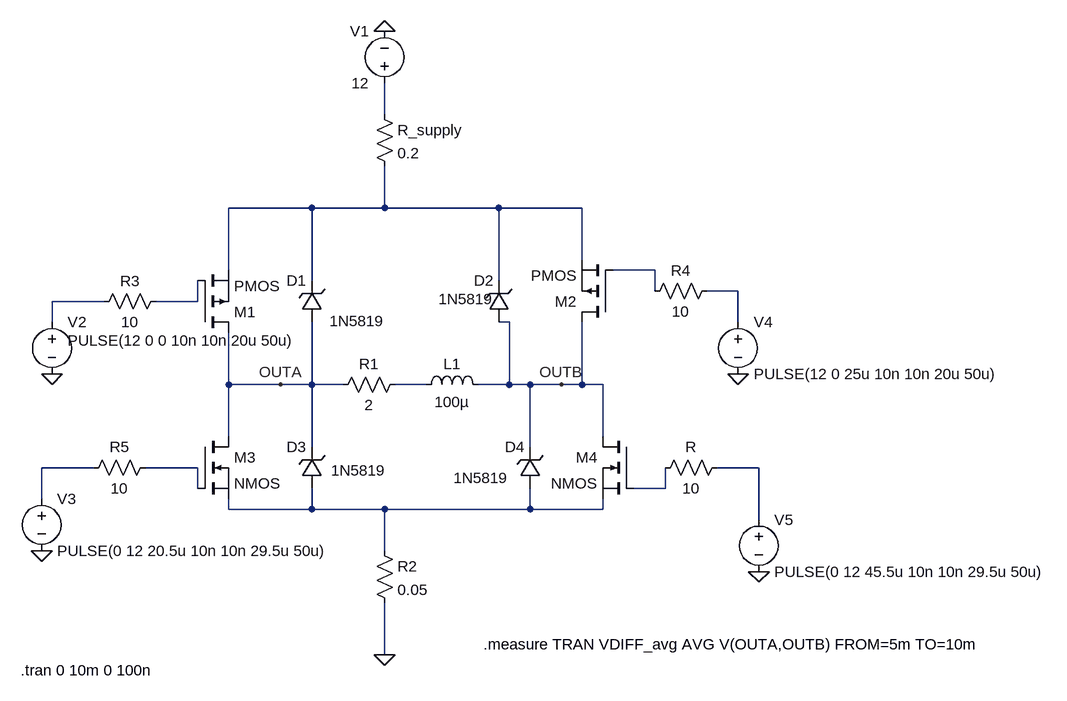
[diagram p0: schematic LTspice_circuit_test_v_diff_basic.asc]
LTspice_circuit_test_v_diff_basic.asc, the LTspice schematic file:
Version 4.1
SHEET 1 1772 968
WIRE 128 96 128 48
WIRE 16 240 -112 240
WIRE 128 240 128 176
WIRE 128 240 16 240
WIRE 304 240 128 240
WIRE 432 240 304 240
WIRE 432 320 432 240
WIRE -112 336 -112 240
WIRE 544 336 480 336
WIRE 16 352 16 240
WIRE 304 352 304 240
WIRE 544 368 544 336
WIRE 672 368 624 368
WIRE -304 384 -384 384
WIRE -160 384 -160 352
WIRE -160 384 -224 384
WIRE -384 416 -384 384
WIRE 320 416 304 416
WIRE 672 416 672 368
WIRE -112 512 -112 432
WIRE -32 512 -112 512
WIRE 16 512 16 416
WIRE 16 512 -32 512
WIRE 64 512 16 512
WIRE 192 512 144 512
WIRE 320 512 320 416
WIRE 320 512 272 512
WIRE 352 512 320 512
WIRE 400 512 352 512
WIRE 432 512 432 416
WIRE 432 512 400 512
WIRE 464 512 432 512
WIRE -112 592 -112 512
WIRE 464 592 464 512
WIRE 16 608 16 512
WIRE 352 608 352 512
WIRE -320 640 -400 640
WIRE -160 640 -240 640
WIRE 704 640 640 640
WIRE -160 672 -160 640
WIRE 560 672 560 640
WIRE 560 672 512 672
WIRE -400 688 -400 640
WIRE -112 704 -112 688
WIRE 16 704 16 672
WIRE 16 704 -112 704
WIRE 128 704 16 704
WIRE 352 704 352 672
WIRE 352 704 128 704
WIRE 464 704 464 688
WIRE 464 704 352 704
WIRE 704 720 704 640
WIRE 128 768 128 704
WIRE 128 928 128 848
FLAG 672 496 0
FLAG 704 800 0
FLAG -400 768 0
FLAG -384 496 0
FLAG 128 -32 0
FLAG 128 928 0
FLAG -32 512 OUTA
FLAG 400 512 OUTB
SYMBOL voltage 128 64 R180
WINDOW 0 24 96 Left 2
WINDOW 3 24 16 Left 2
WINDOW 123 0 0 Left 0
WINDOW 39 0 0 Left 0
SYMATTR InstName V1
SYMATTR Value 12
SYMBOL nmos -160 592 R0
SYMATTR InstName M3
SYMBOL nmos 512 592 M0
SYMATTR InstName M4
SYMBOL zener 32 416 R180
WINDOW 0 24 64 Left 2
WINDOW 3 -96 2 Left 2
SYMATTR InstName D1
SYMATTR Value 1N5819
SYMBOL zener 320 416 R180
WINDOW 0 24 64 Left 2
WINDOW 3 24 36 Left 2
SYMATTR InstName D2
SYMATTR Value 1N5819
SYMBOL zener 32 672 R180
WINDOW 0 24 64 Left 2
WINDOW 3 -98 28 Left 2
SYMATTR InstName D3
SYMATTR Value 1N5819
SYMBOL zener 368 672 R180
WINDOW 0 24 64 Left 2
WINDOW 3 49 16 Left 2
SYMATTR InstName D4
SYMATTR Value 1N5819
SYMBOL res 160 496 R90
WINDOW 0 0 56 VBottom 2
WINDOW 3 32 56 VTop 2
SYMATTR InstName R1
SYMATTR Value 2
SYMBOL ind 176 528 R270
WINDOW 0 32 56 VTop 2
WINDOW 3 5 56 VBottom 2
SYMATTR InstName L1
SYMATTR Value 100µ
SYMBOL voltage -384 400 R0
WINDOW 3 24 44 Left 2
WINDOW 123 0 0 Left 0
WINDOW 39 0 0 Left 0
SYMATTR InstName V2
SYMATTR Value PULSE(12 0 0 10n 10n 20u 50u)
SYMBOL voltage -400 672 R0
WINDOW 123 0 0 Left 0
WINDOW 39 0 0 Left 0
SYMATTR InstName V3
SYMATTR Value PULSE(0 12 20.5u 10n 10n 29.5u 50u)
SYMBOL voltage 672 400 R0
WINDOW 123 0 0 Left 0
WINDOW 39 0 0 Left 0
SYMATTR InstName V4
SYMATTR Value PULSE(12 0 25u 10n 10n 20u 50u)
SYMBOL voltage 704 704 R0
WINDOW 123 0 0 Left 0
WINDOW 39 0 0 Left 0
SYMATTR InstName V5
SYMATTR Value PULSE(0 12 45.5u 10n 10n 29.5u 50u)
SYMBOL res 112 752 R0
SYMATTR InstName R2
SYMATTR Value 0.05
SYMBOL res 112 80 R0
SYMATTR InstName R_supply
SYMATTR Value 0.2
SYMBOL res -208 368 R90
WINDOW 0 0 56 VBottom 2
WINDOW 3 32 56 VTop 2
SYMATTR InstName R3
SYMATTR Value 10
SYMBOL res 640 352 R90
WINDOW 0 0 56 VBottom 2
WINDOW 3 32 56 VTop 2
SYMATTR InstName R4
SYMATTR Value 10
SYMBOL res -224 624 R90
WINDOW 0 0 56 VBottom 2
WINDOW 3 32 56 VTop 2
SYMATTR InstName R5
SYMATTR Value 10
SYMBOL res 656 624 R90
WINDOW 0 0 56 VBottom 2
WINDOW 3 32 56 VTop 2
SYMATTR InstName R
SYMATTR Value 10
SYMBOL pmos 480 416 R180
SYMATTR InstName M2
SYMBOL pmos -160 432 M180
SYMATTR InstName M1
TEXT -432 952 Left 2 !.tran 0 10m 0 100n
TEXT 280 912 Left 2 !.measure TRAN VDIFF_avg AVG V(OUTA,OUTB) FROM=5m TO=10m

The netlist it stands for:
* LTspice_circuit_test_v_diff_basic.asc
V1 N001 0 12
M3 OUTA N009 N012 N012 NMOS
M4 OUTB N011 N012 N012 NMOS
D1 OUTA N002 1N5819
D2 OUTB N002 1N5819
D3 N012 OUTA 1N5819
D4 N012 OUTB 1N5819
R1 N007 OUTA 2
L1 N007 OUTB 100µ
V2 N005 0 PULSE(12 0 0 10n 10n 20u 50u)
V3 N008 0 PULSE(0 12 20.5u 10n 10n 29.5u 50u)
V4 N004 0 PULSE(12 0 25u 10n 10n 20u 50u)
V5 N010 0 PULSE(0 12 45.5u 10n 10n 29.5u 50u)
R2 N012 0 0.05
R_supply N001 N002 0.2
R3 N006 N005 10
R4 N004 N003 10
R5 N009 N008 10
R N010 N011 10
M2 OUTB N003 N002 N002 PMOS
M1 OUTA N006 N002 N002 PMOS
.model D D
.lib standard.dio
.model NMOS NMOS
.model PMOS PMOS
.lib standard.mos
.tran 0 10m 0 100n
.measure TRAN VDIFF_avg AVG V(OUTA,OUTB) FROM=5m TO=10m
.backanno
.end